# Altium project walktimizer_v1.PrjPcb
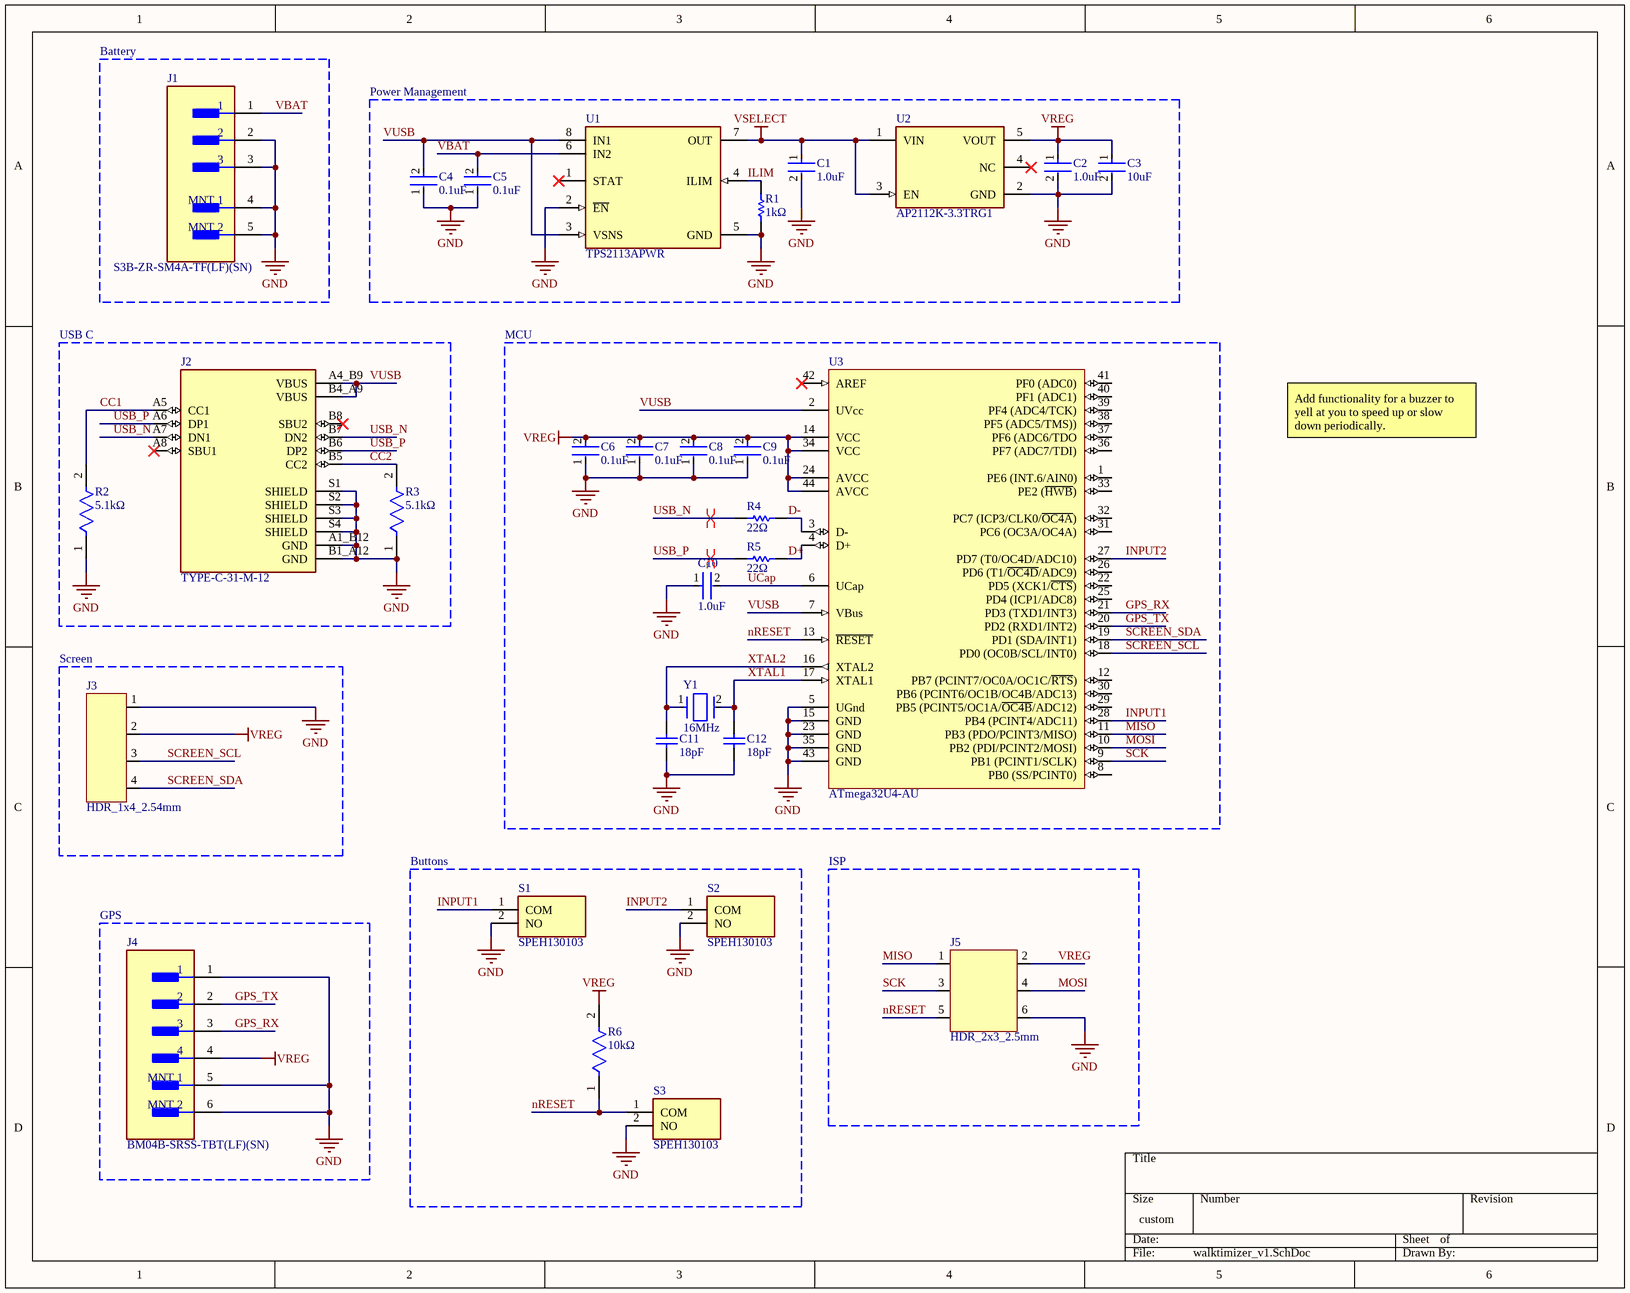
[diagram p0: walktimizer_v1.SchDoc]
1 sheet, 30 parts. Net scope: global (net labels, ports and power ports of the same name join across sheets).
Board file: walktimizer_v1.PcbDoc

## Sheet walktimizer_v1.SchDoc
size 304 x 241 mm; SheetNumber: 1; SheetTotal: 1

### Parts
C1  1.0uF  [FP-GRT188-0_1-e0_2_0_5-IPC_B]
C2  1.0uF  [FP-GRT188-0_1-e0_2_0_5-IPC_B]
C3  10uF  [FP-GRM188-0_1-e0_2_0_55-IPC_A]
C4  0.1uF  [FP-GRM15-MFG]
C5  0.1uF  [FP-GRM15-MFG]
C6  0.1uF  [FP-GRM15-MFG]
C7  0.1uF  [FP-GRM15-MFG]
C8  0.1uF  [FP-GRM15-MFG]
C9  0.1uF  [FP-GRM15-MFG]
C10  1.0uF  [FP-GRT188-0_1-e0_2_0_5-IPC_B]
C11  18pF  [CAPC1608X90X40LL10T20]
C12  18pF  [CAPC1608X90X40LL10T20]
J1  S3B-ZR-SM4A-TF(LF)(SN)  [FP-S3B-ZR-SM4A-TF_LF_SN-MFG]
J2  TYPE-C-31-M-12  [HRO_TYPE-C-31-M-12]
J3  HDR_1x4_2.54mm  [HDR_1x4_2.5mm_TH]
J4  BM04B-SRSS-TBT(LF)(SN)  [FP-BM04B-SRSS-TBT_LF_SN-MFG]
J5  HDR_2x3_2.5mm  [HDR_2x3_2.5mm_TH]
R1  1kΩ  [RESC2013X60X35ML10T20]
R2  5.1kΩ  [FP-CRCW0603-e3-IPC_C]
R3  5.1kΩ  [FP-CRCW0603-e3-IPC_C]
R4  22Ω  [RESC1005X40X25LL05T05]
R5  22Ω  [RESC1005X40X25LL05T05]
R6  10kΩ  [FP-RC0603-0_55-IPC_C]
S1  SPEH130103  [SPEH130103]
S2  SPEH130103  [SPEH130103]
S3  SPEH130103  [SPEH130103]
U1  TPS2113APWR  [FP-PW0008A-IPC_B]
U2  AP2112K-3.3TRG1  [FP-SOT25-IPC_A]
U3  ATmega32U4-AU  [44ML_M]
Y1  16MHz  [FP-ABM3-MFG]

### Blocks framed on the sheet
Battery: J1
Power Management: C1-C5 R1 U1 U2
USB C: J2 R2 R3
MCU: C6-C12 R4 R5 U3 Y1
Screen: J3
Buttons: R6 S1-S3
ISP: J5
GPS: J4

### Nets
GND: C1.2 C2.2 C3.2 C4.1 C5.1 C6.1 C7.1 C8.1 C9.1 C10.1 C11.1 C12.1 J1.2 J1.3 J1.4(MNT_1) J1.5(MNT_2) J2.A1_B12(GND) J2.B1_A12(GND) J2.S1(SHIELD) J2.S2(SHIELD) J2.S3(SHIELD) J2.S4(SHIELD) J3.1 J4.1 J4.5(MNT_1) J4.6(MNT_2) J5.6 R1.1 R2.1 R3.1 S1.2(NO) S2.2(NO) S3.2(NO) U1.2(~{EN}) U1.5(GND) U2.2(GND) U3.5(UGnd) U3.15(GND) U3.23(GND) U3.35(GND) U3.43(GND)
VREG: C2.1 C3.1 C6.2 C7.2 C8.2 C9.2 J3.2 J4.4 J5.2 R6.2 U2.5(VOUT) U3.14(VCC) U3.24(AVCC) U3.34(VCC) U3.44(AVCC)
VSELECT: C1.1 U1.7(OUT) U2.1(VIN) U2.3(EN)
CC1: J2.A5(CC1) R2.2
CC2: J2.B5(CC2) R3.2
D+: R5.2 U3.4(D+)
D-: R4.2 U3.3(D-)
GPS_RX: J4.3 U3.21(PD3_(TXD1/INT3))
GPS_TX: J4.2 U3.20(PD2_(RXD1/INT2))
ILIM: R1.2 U1.4(ILIM)
INPUT1: S1.1(COM) U3.28(PB4_(PCINT4/ADC11))
INPUT2: S2.1(COM) U3.27(PD7_(T0/OC4D/ADC10))
MISO: J5.1 U3.11(PB3_(PDO/PCINT3/MISO))
MOSI: J5.4 U3.10(PB2_(PDI/PCINT2/MOSI))
nRESET: J5.5 R6.1 S3.1(COM) U3.13(~{RESET})
SCK: J5.3 U3.9(PB1_(PCINT1/SCLK))
SCREEN_SCL: J3.3 U3.18(PD0_(OC0B/SCL/INT0))
SCREEN_SDA: J3.4 U3.19(PD1_(SDA/INT1))
UCap: C10.2 U3.6(UCap)
USB_N: J2.A7(DN1) J2.B7(DN2) R4.1
USB_P: J2.A6(DP1) J2.B6(DP2) R5.1
VBAT: C5.2 J1.1 U1.6(IN2)
VUSB: C4.2 J2.A4_B9(VBUS) J2.B4_A9(VBUS) U1.3(VSNS) U1.8(IN1) U3.2(UVcc) U3.7(VBus)
XTAL1: C12.2 U3.17(XTAL1) Y1.2
XTAL2: C11.2 U3.16(XTAL2) Y1.1

Not connected (* = marked no-connect by the designer): J2 A8(SBU1)* B8(SBU2)*; U1 1(STAT)*; U2 4(NC)*; U3 1(PE6_(INT.6/AIN0)) 8(PB0_(SS/PCINT0)) 12(PB7_(PCINT7/OC0A/OC1C/~{RTS})) 22(PD5_(XCK1/~{CTS})) 25(PD4_(ICP1/ADC8)) 26(PD6_(T1/~{OC4D}/ADC9)) 29(PB5_(PCINT5/OC1A/~{OC4B}/ADC12)) 30(PB6_(PCINT6/OC1B/OC4B/ADC13)) 31(PC6_(OC3A/OC4A)) 32(PC7_(ICP3/CLK0/~{OC4A})) 33(PE2_(~{HWB})) 36(PF7_(ADC7/TDI)) 37(PF6_(ADC6/TDO) 38(PF5_(ADC5/TMS))) 39(PF4_(ADC4/TCK)) 40(PF1_(ADC1)) 41(PF0_(ADC0)) 42(AREF)*

### Layout directives
differential pair; differential pair class USB: USB_N, USB_P

### Notes on the sheet
- Add functionality for a buzzer to yell at you to speed up or slow down periodically.

### Library data of the parts
C1 C2 C10 = CMP-06035-031856-1: Multi-Layer Ceramic Capacitor 1uF 50V X5R ±10% 0603 Paper T/R / GRT188R61H105KE13D; Voltage Rating (DC): 50V; Voltage Rating: 50V; Min Operating Temperature: -55°C; Case Code (Metric): 1608; Thickness: 0.035inch; Width: 0.031inch; Capacitance: 1uF; Tolerance: 10%; Max Operating Temperature: 85°C; Dielectric: X5R; Case Code (Imperial): 0603; Case/Package: 0603; Length: 0.063inch; Packaging: Tape and Reel; Mount: Surface Mount; Ratings: AEC-Q200
C3 = CMP-2006-02792-2: Chip Multilayer Ceramic Capacitors for General Purpose, 0603, 10uF, X5R, 15%, 20%, 6.3V / GRM188R60J106ME47D; Packaging: Tape and Reel; Voltage Rating (DC): 6.3V; Width: 0.031inch; Termination: SMD/SMT; Dielectric: X5R; Package Quantity: 4000; Voltage Rating: 6.3V; Capacitance: 10uF; Case/Package: 0603; Min Operating Temperature: -55°C; Voltage: 6.3V; Length: 1.6mm; Thickness: 0.035inch; Lead Free: Lead Free; Depth: 0.8mm; Case Code (Imperial): 0603; Max Operating Temperature: 85°C; Material: Ceramic; Height: 0.8mm; Tolerance: 20%; Mount: Surface Mount; REACH SVHC: No SVHC; Radiation Hardening: No; Case Code (Metric): 1608
C4-C9 = CMP-2100-03641-2: CAP CER 0.1UF 16V X7R 0402 / GRM155R71C104KA88D; Manufacturer: Murata; Standoff Height: 0mm; Tolerance: 10%; Voltage Rating: 16Vdc; Material: Ceramic; Capacitance: 0.10μF; Value: 0.10μF; RoHS: TRUE; Manufacturer Part Number: GRM155R71C104KA88D; Temperature Characteristic: X7R; Octopart: https://octopart.com/grm155r71c104ka88d-murata-196880; Digikey Description: CAP CER 0.1UF 16V X7R 0402; Device Class L3: Ceramic Capacitors; Height: 0.55mm; ComponentLink2Description: Datasheet; Temperature Range Low: -55°C; Ipc Land Pattern Name: CAPC10050X219; ComponentLink2URL: https://search.murata.co.jp/Ceramy/image/img/A01X/G101/ENG/GRM155R71H471KA01-01A.pdf; Device Class L1: Passive Components; Lead Free: yes; Category: Cap; Package: GRM15; Temperature: -55°C to +125°C; Device Class L2: Capacitors; Temperature Range High: +125°C; Mouser Description: 0402 0.1 uF 16V ±10 % Tolerance X7R SMT Multilayer Ceramic Capacitor
C11 C12 = CMP-1659-00030-1: Chip Capacitor, 18 pF, +/- 5%, 50 V, -55 to 125 degC, 0603 (1608 Metric), RoHS, Tape and Reel / CC0603JRNPO9BN180; Voltage Rating: 50 V; Case\Package: 0603; Power Rating: 100 mW; Resistance: 68.1 Ohm; Tolerance: 1%; Case Code (Metric): 1608; Max Operating Temperature: 155 degC; RoHSCompliant: true; Case Code (Imperial): 0603; ComponentLink2Description: Datasheet; Package Quantity: 200; PackageReference: 0603; ComponentLink2URL: http://www.yageo.com/NewPortal/yageodocoutput?fileName=/pdf/MLCC/UPY-GP_NP0_16V-to-50V_14.pdf; Length: 1.6 mm; DatasheetVersion: Rev. 14, 07/2016; Min Operating Temperature: -55 degC; ComponentLink1URL: http://www.yageo.com/; Width: 0.8 mm; ComponentLink1Description: Manufacturer URL; Height: 0.45 mm; Radiation Hardening: No; PackageDescription: 2-Pin Surface Mount Device, Body 1.6 x 0.8 mm; Packaging: Tape and Reel
J1 = CMP-17439-000744-1: CONN HEADER SMD R/A 3POS 1.5MM; Number of Contacts: 3; Contact Resistance: 30mR; Gender: Male; Voltage Rating: 50V; Max Current Rating: 1A; Orientation: Right Angle; Flammability Rating: UL94 V-0; Housing Color: Beige; Insulation Material: Nylon; Max Operating Temperature: 85°C; Min Operating Temperature: -25°C; Packaging: Tape and Reel; Contact Shape: Circular; Depth: 6.5mm; Mount: Surface Mount; Insulation Color: Natural; Width: 3.5mm; Number of Rows: 1; Termination: Solder; Color: Natural; Contact Plating: Copper; Contact Type: Male Pin; Pitch: 1.5mm; Length: 7.5mm; Number of Positions: 3; Housing Material: Polyamide; Max Voltage Rating (AC): 50V; Fastening Type: Detent; Lead Free: Lead Free; Series: ZH; Contact Finish - Mating: TIN; Connector Type: Header; Current Rating: 1A; Contact Material: Brass; Height: 7.2mm
J2 = TYPE-C-31-M-12: USB Connectors 24 Receptacle 1 8.94*7.3mm RoHS; MF: HRO Electronics Co., Ltd.; Price: None; Value: *; SnapEDA_Link: https://www.snapeda.com/parts/TYPE-C-31-M-12/HRO+Electronics+Co.%252C+Ltd./view-part/?ref=snap; Package: Package; Availability: Not in stock; Check_prices: https://www.snapeda.com/parts/TYPE-C-31-M-12/HRO+Electronics+Co.%252C+Ltd./view-part/?ref=eda; MP: TYPE-C-31-M-12
J3 = HDR_1x4_2.54mm: 2x3 2.54mm Pitch Header
J4 = CMP-17439-000370-1: CONN HEADER SMD 4POS 1MM; Voltage Rating: 50V; Number of Positions: 4; Pitch: 0.039inch; Mated Stacking Heights: 4.9mm; Packaging: Cut Tape; Contact Material: Copper Alloy; Lead Free: Lead Free; Contact Type: Male Pin; Fastening Type: Pull; Connector Type: Header; Contact Finish - Mating: TIN; Series: SR; Number of Rows: 1; Contact Shape: Square; Package Quantity: 1; Color: Natural; Flammability Rating: UL94 V-0; Mount: Surface Mount; Insulation Color: Natural; Termination: Solder; Contact Plating: Tin; Insulation Material: Nylon
J5 = HDR_2x3_2.5mm: 2x3 2.54mm Pitch Header
R1 = CMP-2100-03671-1: Chip Resistor, 1 KOhm, +/- 1%, 125 mW, -55 to 155 degC, 0805 (2012 Metric), RoHS, Tape and Reel / RC0805FR-071KL; Manufacturer: Yageo; Temperature Coefficient: 100ppm/degreesC; Voltage Rating (DC): 150V; Max Power Dissipation: 125mW; Resistance: 1KOhm; Number of Pins: 2; Number of Terminations: 2; Datasheet URL: http://www.yageo.com/NewPortal/yageodocoutput?fileName=/pdf/R-Chip/PYu-RC_Group_51_RoHS_L_5.pdf; Length: 0.079inch; Package Description: 2-Pin Surface Mounted Device, Body 2 x 1.25 mm; Depth: 1.25mm; Height: 0.024inch; Military Standard: Not; Case/Package: 0805; Package Reference: 0805; RoHSCompliant: true; Lead Free: LeadFree; Packaging: TapeandReel; Package Quantity: 1; Datasheet Version: Rev. 5, 10/2016; Tolerance: 1%; Min Operating Temperature: -55degC; Voltage Rating: 150V; Composition: ThickFilm; Case Code (Imperial): 0805; Power Rating: 125mW; Width: 0.049inch; Case Code (Metric): 2012; Manufacturer URL: http://www.yageo.com/; Max Operating Temperature: 155degC; REACH SVHC: Unknown; Termination: SMD/SMT
R2 R3 = CMP-1012-00590-3: RES Thick Film, 5.1kΩ, 1%, 0.1W, 100ppm/°C, 0603 / CRCW06035K10FKEA; Power Rating: 100mW; Voltage Rating (DC): 75V; Resistance: 5.1kR; Width: 0.85mm; Depth: 0.85mm; Military Standard: Not; Package Quantity: 5000; Case Code (Metric): 1608; Length: 1.55mm; Weight: 7.1E-05oz; Packaging: Tape and Reel; Temperature Coefficient: 100ppm/°C; Case Code (Imperial): 0603; Lead Free: Lead Free; Radiation Hardening: No; Contact Plating: Tin; Composition: Thick Film; Max Operating Temperature: 155°C; Termination: SMD/SMT; Case/Package: 0603; Min Operating Temperature: -55°C; Tolerance: 1%; Voltage Rating: 75V; Mount: Surface Mount; Height: 0.45mm
R4 R5 = CMP-2002-08382-1: CRCW040222R0FKED; Manufacturer: Vishay Dale; Part Number: CRCW040222R0FKED
R6 = CMP-2100-03664-2: RES 10K OHM 1% 1/10W 0603 / RC0603FR-0710KL; Voltage Rating: 75V; Voltage Rating (DC): 50V; Resistance: 10kR; Power Rating: 100mW; Temperature Coefficient: 100ppm/°C; Depth: 0.8mm; Termination: SMD/SMT; Resistor Type: Thick Film; Series: RC; Construction: Rectangular; Features: Moisture Resistant; Packaging: Tape and Reel; Min Operating Temperature: -55°C; Number of Terminations: 2; Lead Pitch: 0.3mm; RoHS Compliant: Yes; Case/Package: 0603; Resistance Tolerance: 1%; Military Standard: Not; Weight: 7.1E-05oz; Number of Pins: 2; Tolerance: 1%; Length: 1.6mm; Case Code (Imperial): 0603; Lead Free: Lead Free; Width: 0.8mm; Max Power Dissipation: 100mW; Height: 0.45mm; Max Operating Temperature: 155°C; Case Code (Metric): 1608; Size Code: 0603
S1-S3 = SPEH130103: Switch; Manufacturer_Name: ALPS Electric; Height: 5mm; Manufacturer_Part_Number: SPEH130103; Mouser Part Number: 688-SPEH130101; Mouser Price/Stock: https://www.mouser.co.uk/ProductDetail/Alps-Alpine/SPEH130103?qs=j%252B1pi9TdxUbHXO0CqM0%2FEw%3D%3D
U1 = CMP-0339-00047-3: IC OR CTRLR SRC SELECT 8TSSOP; Current - Output 2: 1.25A; Number of Outputs: 1; Turn-On Delay Time: 1ms; Max Power Dissipation: 387mW; Operating Supply Current: 55uA; Turn-Off Delay Time: 5ms; Min Input Voltage: 2.8V; Output Voltage: 6V; Number of Inputs: 2; Operating Supply Voltage: 5.5V; On-State Resistance: 84mR; Max Operating Temperature: 85°C; Package Quantity: 2000; Min Operating Temperature: -40°C; Case/Package: TSSOP; REACH SVHC: No SVHC; Packaging: Tape and Reel; Weight: 0.001376oz; Number of Pins: 8; Output Current: 1.25A; Radiation Hardening: No; Max Output Current: 1.25A; Lead Free: Lead Free; Max Input Voltage: 5.5V
U2 = CMP-12756-000035-1: IC REG LINEAR 3.3V 600MA SOT25; Number of Regulators: 1; Output Type: Fixed; Polarity: Positive; Min Input Voltage: 2.5V; Max Input Voltage: 6V; Accuracy: 1.5%; Quiescent Current: 55uA; Dropout Voltage: 250mV; Min Operating Temperature: -40°C; Length: 3.1mm; Output Current: 600mA; Max Operating Temperature: 85°C; Package Quantity: 1; Output Voltage: 3.3V; Width: 1.7mm; Number of Outputs: 1; Packaging: Tape and Reel; Height: 1.3mm; Lead Free: Lead Free; Max Output Current: 600mA; Case/Package: SOT-23-5; Mount: Surface Mount; Number of Pins: 5
U3 = CMP-0095-00285-2: 8-bit AVR Microcontroller, 2.7-5.5V, 16MHz, 32KB Flash, 1KB EEPROM, 2.5KB SRAM, USB Controller, 44-pin TQFP, Industrial Grade (-40°C to 85°C), Ext Osc; RevisionNote: DatasheetVersion updated. URLs added.; ComponentLink1Description: Manufacturer URL; PackageDescription: 44-Pin Plastic Thin Quad Flat Pack, 10 x 10 x 1.0 mm Body, 0.8 mm Pitch (TQFP); DatasheetVersion: revF, Nov-2010; ComponentLink2URL: http://www.atmel.com/dyn/resources/prod_documents/doc7766.pdf; ComponentLink1URL: http://www.atmel.com/; PackageReference: 44ML; ComponentLink2Description: ATmega16U4/32U4 Datasheet; PackageVersion: rev.G, Jul-2007; ComponentLink3URL: http://www.atmel.com/dyn/resources/prod_documents/7766S.pdf; ComponentLink3Description: ATmega16U4 ATmega32U4 Summary
Y1 = CMP-27762-004490-1: Crystal 16MHz ±20ppm 18pF SMD-2 5mm x 3.2mm / ABM3-16.000MHZ-D2Y-T; Frequency Stability: 30ppm; Series Resistance: 40R; Tolerance: 20ppm; Frequency Tolerance: 20ppm; Load Capacitance: 18pF; Resistor Type: Ceramic; Termination: SMD/SMT; Width: 0.126inch; Mount: Surface Mount; RoHS Compliant: Yes; Package Quantity: 1000; Height: 0.051inch; Length: 0.197inch; Frequency: 16MHz; Operating Frequency: 16 MHz; Packaging: Tape and Reel; Max Operating Temperature: 85°C; Series: ABM3; Case/Package: SMD/SMT; Lead Free: Lead Free; ESR (Equivalent Series Resistance): 40R; Number of Pins: 2; Min Operating Temperature: -40°C